# Altium schematic sheet ESP.SchDoc
size A; SheetNumber: 3; SheetTotal: 5
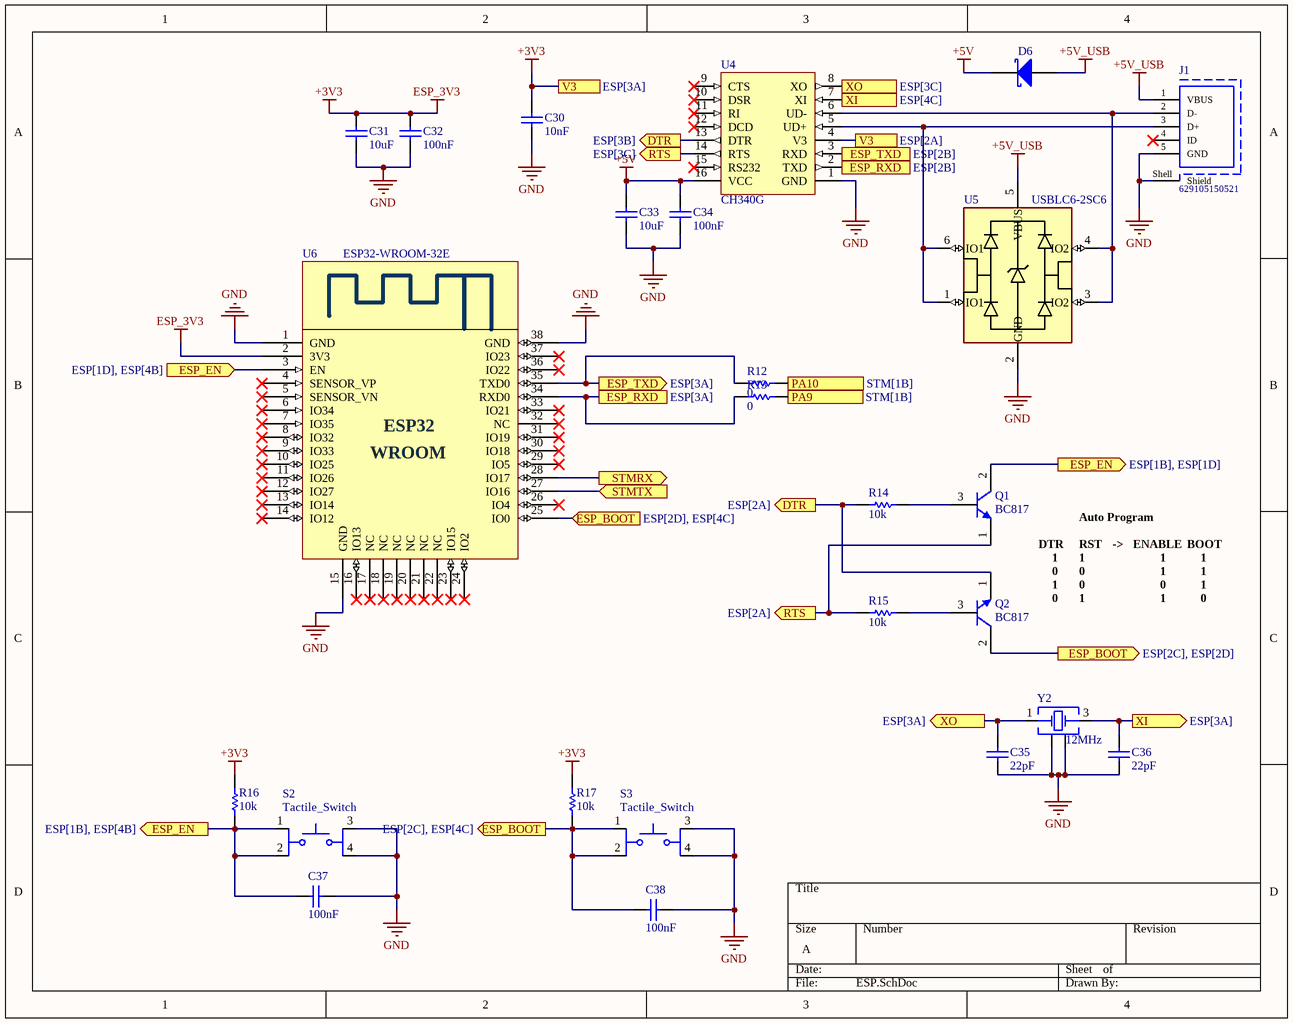
[diagram p0: ESP.SchDoc]

## Parts
C30  10nF  [CAP_0603]
C31  10uF  [CAP_0603]
C32  100nF  [CAP_0603]
C33  10uF  [CAP_0603]
C34  100nF  [CAP_0603]
C35  22pF  [CAP_0603]
C36  22pF  [CAP_0603]
C37  100nF  [CAP_0603]
C38  100nF  [CAP_0603]
D6  D Schottky  [SS34]  (value not drawn)
J1  629105150521  [629105150521]
Q1  BC817  [SOT23B]
Q2  BC817  [SOT23B]
R12  0  [resistor_0603]
R13  0  [resistor_0603]
R14  10k  [resistor_0603]
R15  10k  [resistor_0603]
R16  10k  [resistor_0603]
R17  10k  [resistor_0603]
S2  Tactile_Switch  [Tactile_Button_3x4x2.5]
S3  Tactile_Switch  [Tactile_Button_3x4x2.5]
U4  CH340G  [DSIP-16]
U5  USBLC6-2SC6  [SOT95P280X145-6N]
U6  ESP32-WROOM-32E  [ESP32-WROOM]
Y2  12MHz  [WE-XTAL_CFPX-104]

## Ports
DTR (out, see ESP[2A]), DTR (out, see ESP[3B]), ESP_BOOT (in, see ESP[2D], ESP[4C]), ESP_BOOT (out, see ESP[2C], ESP[2D]), ESP_BOOT (out, see ESP[2C], ESP[4C]), ESP_EN (in, see ESP[1D], ESP[4B]), ESP_EN (out, see ESP[1B], ESP[1D]), ESP_EN (out, see ESP[1B], ESP[4B]), ESP_RXD (see ESP[2B]), ESP_RXD (see ESP[3A]), ESP_TXD (out, see ESP[3A]), ESP_TXD (see ESP[2B]), PA9 (in, see STM[1B]), PA10 (out, see STM[1B]), RTS (out, see ESP[2A]), RTS (out, see ESP[3C]), STMRX (out), STMTX (in), V3 (see ESP[2A]), V3 (see ESP[3A]), XI (in, see ESP[4C]), XI (out, see ESP[3A]), XO (out, see ESP[3A]), XO (out, see ESP[3C])

## Nets
+3V3: C30.1 C31.1 C32.1 R16.1 R17.1 U4.4(V3) U6.2(3V3) ; port V3  [also labelled ESP_3V3]
+5V: C33.2 C34.2 D6.2(K) U4.16(VCC)
+5V_USB: D6.1(A) J1.1(VBUS) U5.5(VBUS)
GND: C30.2 C31.2 C32.2 C33.1 C34.1 C35.1 C36.1 C37.2 C38.2 J1.5(GND) J1.Shell(Shield) S2.3 S2.4 S3.3 S3.4 U4.1(GND) U5.2(GND) U6.1(GND) U6.15(GND) U6.38(GND) Y2.2(GND_&_Lid) Y2.4(GND_&_Lid)
DTR: Q2.1(E) R14.1 U4.13(DTR) ; port DTR
ESP_BOOT: C38.1 Q2.2(C) R17.2 S3.1 S3.2 U6.25(IO0) ; port ESP_BOOT
ESP_EN: C37.1 Q1.2(C) R16.2 S2.1 S2.2 U6.3(EN) ; port ESP_EN
ESP_RXD: R13.1 U4.2(TXD) U6.34(RXD0) ; port ESP_RXD
ESP_TXD: R12.1 U4.3(RXD) U6.35(TXD0) ; port ESP_TXD
PA9: R13.2 ; port PA9
PA10: R12.2 ; port PA10
RTS: Q1.1(E) R15.1 U4.14(RTS) ; port RTS
STMRX: U6.28(IO17) ; port STMRX
STMTX: U6.27(IO16) ; port STMTX
XI: C36.2 U4.7(XI) Y2.3(Crystal) ; port XI
XO: C35.2 U4.8(XO) Y2.1(Crystal) ; port XO
NetJ1_2: J1.2(D-) U4.6(UD-) U5.3(IO2) U5.4(IO2)
NetJ1_3: J1.3(D+) U4.5(UD+) U5.1(IO1) U5.6(IO1)
NetQ1_3: Q1.3(B) R14.2
NetQ2_3: Q2.3(B) R15.2

Not connected (* = marked no-connect by the designer): J1 4(ID)*; U4 9(CTS)* 10(DSR)* 11(RI)* 12(DCD)* 15(RS232)*; U6 4(SENSOR_VP)* 5(SENSOR_VN)* 6(IO34)* 7(IO35)* 8(IO32)* 9(IO33)* 10(IO25)* 11(IO26)* 12(IO27)* 13(IO14)* 14(IO12)* 16(IO13)* 17(NC)* 18(NC)* 19(NC)* 20(NC)* 21(NC)* 22(NC)* 23(IO15)* 24(IO2)* 26(IO4)* 29(IO5)* 30(IO18)* 31(IO19)* 32(NC)* 33(IO21)* 36(IO22)* 37(IO23)*

## Notes on the sheet
- DTR
- 1
- Auto Program
- RST
- ->
- ENABLE
- BOOT
- 0
- (in symbol ESP32-WROOM) WROOM

## Library data of the parts
C30 = 01060310310: CAP, size 0603, 10nF; Supply 1 SN: 885012206089; Supply 1 name: Wurth Elektronik; Supply 2 name: Thegioiic; Capacitance Tolerance: +/-10%; ComponentLink1Description: Manufacturer; ComponentLink1URL: http://www.we-online.de; ComponentLink2Description: Datasheet; ComponentLink2URL: https://www.we-online.com/catalog/datasheet/885012206089.pdf; Operating Temperature: -55 to +125degC; Packaging: Tape and Reel; Supply 1 URL: https://www.we-online.com/en/components/products/WCAP-CSGP-50VDC?sq=885012206089#885012206089; Supply 2 SN: *; Supply 2 URL: https://www.thegioiic.com/tu-gom-0603-10nf-50v; Dissipation Factor: *; Height: *; Mounting Technology: SMT; Size: 0603; Capacitance: 10nF; Technical Reference: *
C31 C33 = 01060310010: CAP, size 0603,10uF; Supply 2 name: Thegioiic; Capacitance Tolerance: +/-10%; ComponentLink1Description: Manufacturer; ComponentLink1URL: *; ComponentLink2Description: Datasheet; ComponentLink2URL: *; Operating Temperature: -55 to +125degC; Packaging: Tape and Reel; Supply 1 SN: *; Supply 1 name: *; Supply 1 URL: *; Supply 2 SN: *; Supply 2 URL: https://www.thegioiic.com/tu-gom-0603-10uf-16v; Dissipation Factor: *; Height: *; Mounting Technology: SMT; Size: 0603; Capacitance: 10uF; Technical Reference: *
C32 C34 C37 C38 = 01060310410: CAP, size 0603, 100nF; Supply 1 SN: 885012206095; Supply 1 name: Wurth Elektronik; Supply 2 name: Thegioiic; Capacitance Tolerance: +/-10%; ComponentLink1Description: Manufacturer; ComponentLink1URL: http://www.we-online.de; ComponentLink2Description: Datasheet; ComponentLink2URL: https://www.we-online.com/catalog/datasheet/885012206095.pdf; Operating Temperature: -55 to +125degC; Packaging: Tape and Reel; Supply 1 URL: https://www.we-online.com/en/components/products/WCAP-CSGP-50VDC?sq=885012206095R#885012206095R; Supply 2 SN: *; Supply 2 URL: https://www.thegioiic.com/tu-gom-0603-100nf-0-1uf-50v; Dissipation Factor: *; Height: *; Mounting Technology: SMT; Size: 0603; Capacitance: 100nF; Technical Reference: *
C35 C36 = 01060322010: CAP, size 0603, 22pF; Supply 2 name: Thegioiic; Capacitance Tolerance: +/-10%; ComponentLink1Description: Manufacturer; ComponentLink1URL: Thegioiic; ComponentLink2Description: Datasheet; ComponentLink2URL: *; Operating Temperature: -55 to +125degC; Packaging: Tape and Reel; Supply 1 SN: *; Supply 1 name: *; Supply 1 URL: *; Supply 2 SN: *; Supply 2 URL: https://www.thegioiic.com/tu-gom-0603-22pf-50v; *: *; Height: *; Mounting Technology: SMT; Size: 0603; Capacitance: 22pF; Technical Reference: *
D6 = D Schottky: Schottky Diode; Published: 8-Jun-2000; LatestRevisionDate: 17-Jul-2002; LatestRevisionNote: Re-released for DXP Platform.; PackageReference: SMB; Publisher: Altium Limited; PackageDescription: DO-214-AA/SMB; 2 C-Bend Leads; Body 5.3 x 3.6 mm, inc. leads (LxW); Code_JEDEC: DO-214-AA
J1 = 629105150521: Micro USB 2.0 Type B Receptacle WR-COM, Horizontal, SMT, with Pegs, High Current at Pin 1 & Pin 5; Rated Current: 3 A; Contact Resistance: 30 mOhm; Working Voltage: 30 VAC; ComponentLink1Description: Manufacturer; ComponentLink1URL: http://www.we-online.de; ComponentLink2Description: Datasheet; ComponentLink2URL: https://katalog.we-online.de/em/datasheet/629105150521.pdf; Part Number: 629105150521; Published Date: September 2018; Publisher: Wurth Elektronik; Orientation: Horizontal; Connector Type: Micro USB 2.0 Type B; Operating Temperature: -40 to 85 degC; Mounting Technology: SMT; Gender: Receptacle; Packaging: Tape and Reel
Q1 Q2 = BC817: NPN Bipolar Transistor
R12 R13 = 0006030001: RES, 0 Ohm, size 0603, 1%; Resistance tolerance: +/-5%; Rated Power: 1/4 W; Resistance: 2.5K; Size: 0603; Mounting Technology: SMT; Datasheet: *; ComponentLink1Description: Datasheet link; ComponentLink1URL: *; Supply 1 Name: *; Supply 1 SN: *; Supply 1 URL: *; Supply 2 Name: *; Supply 2 SN: *; Supply 2 URL: *; Supply 3 Name: *; Supply 3 SN: *; Supply 3 URL: *; Manufacture  Name: *; Manufacture  SN: *
R14-R17 = 0006031031: RES, 10k Ohm, size 0603, 1%; Resistance Tolerant: +/-1%; Rated Power: 1/4W; Supply 1 Name: Mouser; Supply 1 SN: 755-ESR03EZPF1002; Supply 2 Name: Digikey; Supply 2 SN: RHM10KADTR-ND RHM10KADCT-ND RHM10KADDKR-ND; Resistance: 10k; Size: 0603; Mounting Technology: SMT; ComponentLink1Description: Datasheet link; ComponentLink1URL: https://fscdn.rohm.com/en/products/databook/datasheet/passive/resistor/chip_resistor/esr-e.pdf; ComponentLink2Description: Supply 1 URL; ComponentLink2URL: https://www.mouser.vn/ProductDetail/ROHM-Semiconductor/ESR03EZPF1002?qs=sGAEpiMZZMvdGkrng054t67Efho1F8r6CDeAsqwFse8%3D; ComponentLink3Description: Supply 2 URL; ComponentLink3URL: https://www.digikey.com/en/products/detail/rohm-semiconductor/ESR03EZPF1002/1983429
S2 S3 = Tactile_Switch: Tactile Switch, 3x4x2.5mm; MP: TL6700AF160QG; Supplier 1 URL: https://www.thegioiic.com/nut-nhan-3x4mm-cao-2-5mm-4-chan-smd; Package: None; Price: None; Availability: Unavailable; ComponentLink1Description: New link; ComponentLink1URL: *; Supplier 1 Name: Thegioiic
U4 = CH340: USB Bridge, USB to UART USB 2.0 UART Interface; Mfr: SparkFun Electronics; Standards: USB 2.0; Voltage - Supply: 3V ~ 3.6V; Current - Supply: 20mA; Protocol: USB; Function: Bridge, USB to UART; Interface: UART; Operating Temperature: -20°C ~ 70°C (TA); ComponentLink1Description: Thegioiic; ComponentLink1URL: https://www.thegioiic.com/ch340g; ComponentLink2Description: Datasheet; ComponentLink2URL: https://www.thegioiic.com/upload/documents/5d39d5f0043101a4c964078db79fe1bd.PDF
U5 = USBLC6-2SC6: 17V Clamp 5A (8/20Âµs) Ipp Tvs Diode Surface Mount SOT-23-6
U6 = ESP32-WROOM: Bluetooth, WiFi 802.11b/g/n, Bluetooth v4.2 +EDR, Class 1, 2 and 3 Transceiver Module 2.4GHz ~ 2.5GHz Integrated, Trace Surface Mount; Mfr: Espressif Systems; Utilized IC / Part: ESP32-D0WD-V3; Modulation: CCK, DSSS, OFDM; Data Rate: 150Mbps; Power - Output: 20dBm; Sensitivity: -98dBm; Serial Interfaces: ADC, GPIO, I²C, I²S, PWM, SDIO, SPI, UART; Memory Size: 4MB Flash, 448kB ROM, 536kB SRAM; Voltage - Supply: 3V ~ 3.6V; Category: RF and Wireless; Series: ESP32; RF Family/Standard: Bluetooth, WiFi; Protocol: 802.11b/g/n, Bluetooth v4.2 +EDR, Class 1, 2 and 3; Frequency: 2.4GHz ~ 2.5GHz; Antenna Type: Integrated, Trace; Mounting Type: Surface Mount; ComponentLink1Description: Hshop; ComponentLink1URL: https://hshop.vn/products/mach-thu-phat-wifi-ble-soc-esp32-v1; Operating Temperature: -40°C ~ 85°C; ComponentLink2Description: Datasheet; ComponentLink2URL: https://www.espressif.com/sites/default/files/russianDocumentation/esp32-wroom-32e_esp32-wroom-32ue_datasheet_en.pdf
Y2 = 830055999: WE-XTAL Quartz Crystal, SMT, CFPX-104, 12MHz, +/-30ppm; Manufacturer: Wurth Elektronik; Load Capacitance: 18pF; ComponentLink1Description: Manufacturer; ComponentLink1URL: http://www.we-online.de; ComponentLink2Description: Datasheet; ComponentLink2URL: https://katalog.we-online.com/pbs/datasheet/830055999.pdf; Operating Temperature: -40 to +85degC; Packaging: Tape and Reel; Manufacturer Part Number: 830055999; Published Date: July 2020; Size: CFPX-104; Frequency Stability: +/-30ppm; Frequency: 12MHz; Frequency Tolerance: +/-30ppm; Mounting Technology: SMT